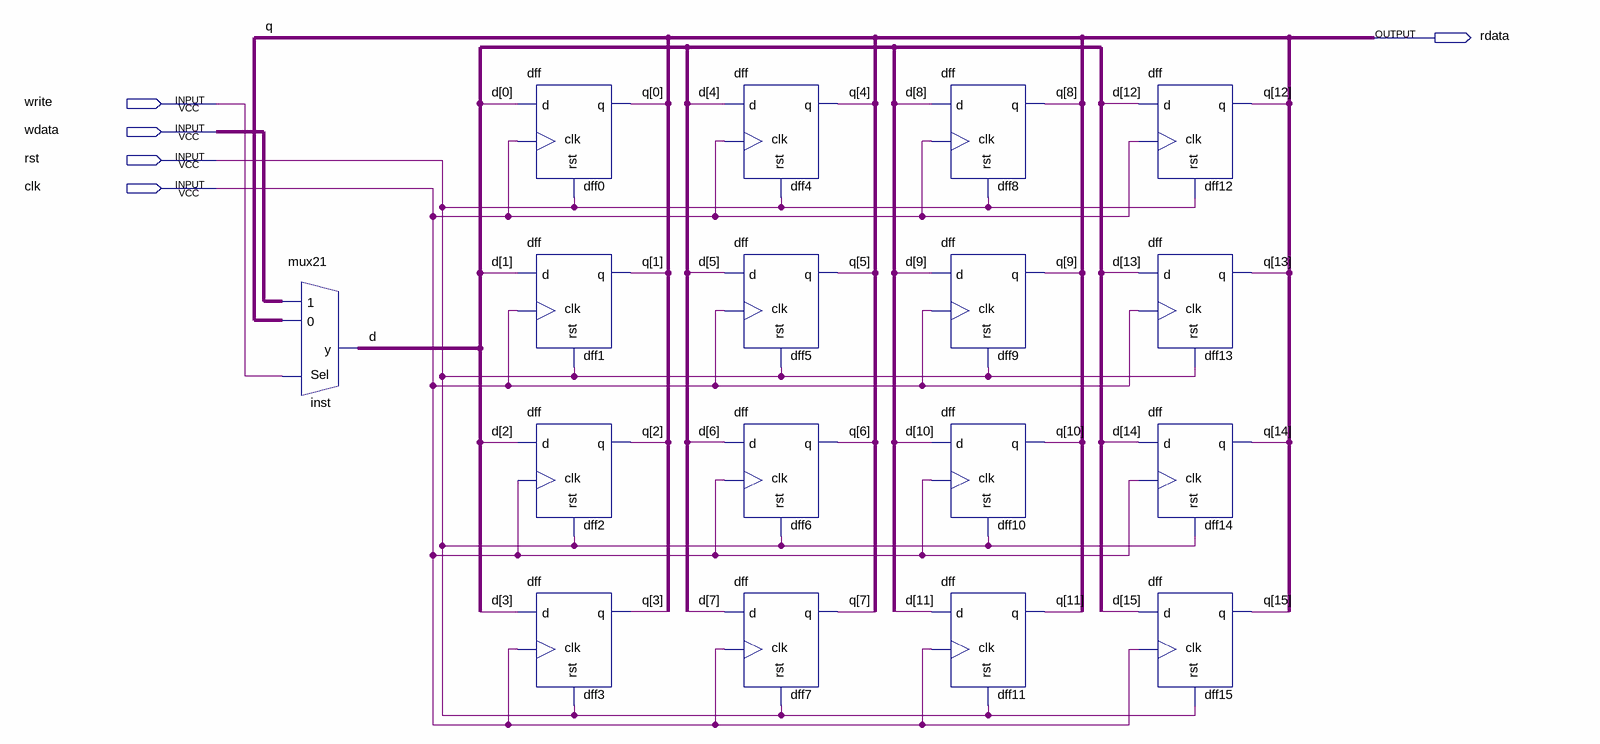
[diagram p0: schematic sheet]
// Quartus schematic register.bdf as structural Verilog: 17 symbols, 5 pins
module register (
  input  write,
  input  wdata,
  input  rst,
  input  clk,
  output rdata
);

  wire d_1bit;
  wire [15:0] d, q;

  mux21 inst (.Sel(write), .\0 (rdata), .\1 (wdata), .y(d_1bit));
  dff dff0 (.d(d[0]), .clk(clk), .rst(rst), .q(q[0]));
  dff dff1 (.d(d[1]), .clk(clk), .rst(rst), .q(q[1]));
  dff dff2 (.d(d[2]), .clk(clk), .rst(rst), .q(q[2]));
  dff dff3 (.d(d[3]), .clk(clk), .rst(rst), .q(q[3]));
  dff dff4 (.d(d[4]), .clk(clk), .rst(rst), .q(q[4]));
  dff dff5 (.d(d[5]), .clk(clk), .rst(rst), .q(q[5]));
  dff dff6 (.d(d[6]), .clk(clk), .rst(rst), .q(q[6]));
  dff dff7 (.d(d[7]), .clk(clk), .rst(rst), .q(q[7]));
  dff dff8 (.d(d[8]), .clk(clk), .rst(rst), .q(q[8]));
  dff dff9 (.d(d[9]), .clk(clk), .rst(rst), .q(q[9]));
  dff dff10 (.d(d[10]), .clk(clk), .rst(rst), .q(q[10]));
  dff dff11 (.d(d[11]), .clk(clk), .rst(rst), .q(q[11]));
  dff dff12 (.d(d[12]), .clk(clk), .rst(rst), .q(q[12]));
  dff dff13 (.d(d[13]), .clk(clk), .rst(rst), .q(q[13]));
  dff dff14 (.d(d[14]), .clk(clk), .rst(rst), .q(q[14]));
  dff dff15 (.d(d[15]), .clk(clk), .rst(rst), .q(q[15]));

  // Other names for the same wires on the sheet: q = rdata
endmodule
